# Altium schematic sheet steering_servo.SchDoc
size A4; SheetNumber: 5; SheetTotal: 8
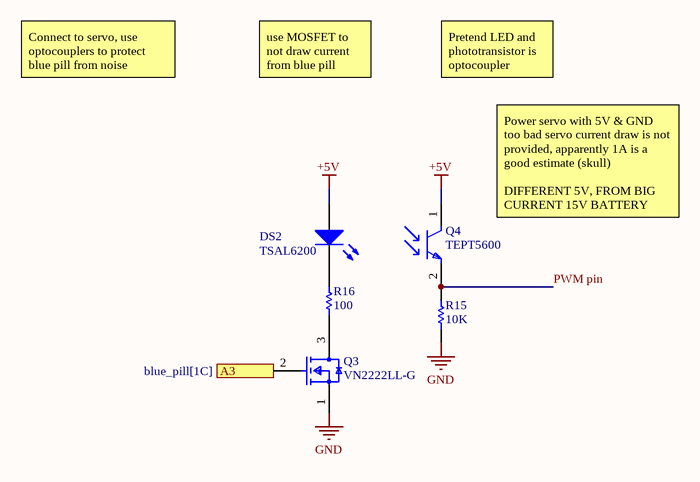
[diagram p0: steering_servo.SchDoc]

## Parts
DS2  TSAL6200  [VISH-TSAL6200]
Q3  VN2222LL-G  [FP-VN2222LL-G-MFG]
Q4  TEPT5600  [FP-6_544-5185_03-4-MFG]
R15  value 10K  (hidden comment: Resistor)
R16  value 100  (hidden comment: Resistor)

## Ports
A3 (in, see blue_pill[1C])

## Nets
+5V: DS2.1(A) Q4.1(C)
GND: Q3.1(SOURCE) R15.2
A3: Q3.2(GATE) ; port A3
PWM pin: Q4.2(E) R15.1
NetDS2_2: DS2.2(K) R16.1
NetQ3_3: Q3.3(DRAIN) R16.2

## Notes on the sheet
- Connect to servo, use optocouplers to protect blue pill from noise
- use MOSFET to not draw current from blue pill
- Pretend LED and phototransistor is optocoupler
- Power servo with 5V & GND
  too bad servo current draw is not provided, apparently 1A is a good estimate (skull)
  DIFFERENT 5V, FROM BIG CURRENT 15V BATTERY

## Library data of the parts
DS2 = CMP-2000-07327-1: High Power Infrared Emitting Diode, GaAlAs, MQW, 1.35 V, 100 mA, -40 to 85 degC, 2-Pin THD, RoHS, Bulk; Manufacturer: Vishay; Lum Intensity: 500mW/srmcd; Product Depth (mm): 5.8mm; Type: IrLED; Luminous Intensity: 500mW/sr; Forward Voltage: 3V; Shape Type: Circular; Peak Wavelength: 950nm; Rad Hardened: No; Product Height (mm): 8.7mm; Number of  Elements: 1; Forward Current: 100mA; High Brightness: Yes; Reverse Voltage: 5V; DELETED: Compliant; Power Dissipation: 160W; Viewing Angle: 34deg; Lens Type: Colored; Packaging: Bulk; Lens Dimensions: 5x5x7.7mm; Package Reference: TSAL6200; Chip Material: GaAlAs; Package Description: 2-Pin Through Hole Device, Dia 5.8 mm, Pitch 2.54 mm; Main Category: IrLED; Manufacturer URL: http://www.vishay.com/; Product Length (mm): 5.8mm; Datasheet URL: http://www.vishay.com/docs/81010/tsal6200.pdf; Operating Temperature Classification: Industrial; Package Type: T-13/4; Pin Count: 2; Mounting: ThroughHole; Mounting Technology: ThroughHole; Test Current (It): 100mA; Datasheet Version: Rev. 2.4, 03/2014; Operating Temp Range: -40Cto85C
Q3 = CMP-06369-000005-1: MOSFET N-CH 60V 0.23A TO92-3; Gate to Source Voltage (Vgs): 30V; Number of Elements: 1; Continuous Drain Current (ID): 230mA; Drain to Source Resistance: 7.5R; Element Configuration: Single; Power Dissipation: 1W; Max Operating Temperature: 150°C; Mount: Through Hole; Radiation Hardening: No; Lead Free: Lead Free; Number of Pins: 3; Packaging: Bulk; Package Quantity: 1000; Min Operating Temperature: -55°C; Case/Package: TO-92; Drain to Source Breakdown Voltage: 60V
Q4 = CMP-02533-000004-1: SENSOR PHOTO 570NM TOP VIEW RAD; Number of Channels: 1; Collector Emitter Voltage (VCEO): 6V; Output Type: Analog; Power Consumption: 100mW; Max Collector Current: 20mA; Lens Style: Domed; Polarity: NPN; Dark Current: 50nA; Viewing Angle: 20°; Operating Supply Voltage: 5V; Package Material: SILICON; Wavelength: 570nm; Width: 5.75mm; Power Dissipation: 100mW; Package Quantity: 4000; Radiation Hardening: No; RoHS Compliant: Yes; Lead Free: Lead Free; Max Power Dissipation: 100mW; Max Operating Temperature: 85°C; Length: 5.75mm; Case/Package: Radial; Number of Elements: 1; Number of Pins: 2; Min Operating Temperature: -40°C; Mount: Through Hole; Height: 8mm; Orientation: Top View; Series: -; Collector Emitter Breakdown Voltage: 6V; Packaging: Bulk
R15 R16 = Resistor: TC1: 0; SimulationGenericComponent: True; TC2: 0